# Altium schematic sheet BrightnessControl.SchDoc
size A; SheetNumber: 1; SheetTotal: 1
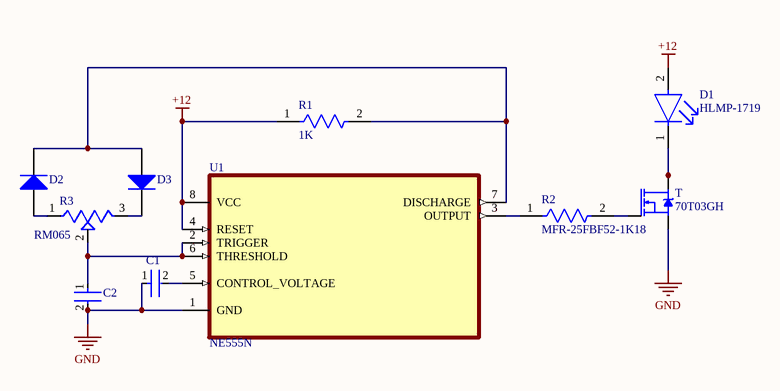
[diagram p0: BrightnessControl.SchDoc]

## Parts
C1  CL21A335KPFNNNG  [FP-CL21-IPC_A]  (value not drawn)
C2  CL21A335KPFNNNG  [FP-CL21-IPC_A]  (value not drawn)
D1  HLMP-1719  [FP-HLMP-1719-MFG]
D2  1N4148  [NXP-SOD27-2_V]  (value not drawn)
D3  1N4148  [NXP-SOD27-2_V]  (value not drawn)
R1  1K  [FP-MFR-25-MFG]
R2  MFR-25FBF52-1K18  [FP-MFR-25-MFG]
R3  RM065  [RM065]
T  70T03GH  [TO252-3]
U1  NE555N  [DIP8]

## Nets
+12: D1.2(A) R1.1 U1.4(RESET) U1.8(VCC)
GND: C1.1 C2.2 T.3(S) U1.1(GND)
NetC1_2: C1.2 U1.5(CONTROL_VOLTAGE)
NetC2_1: C2.1 R3.2(WIPER) U1.2(TRIGGER) U1.6(THRESHOLD)
NetD1_1: D1.1(C) T.2(D) T.PAD(D)
NetD2_1: D2.1(A) R3.1(CCW)
NetD2_2: D2.2(K) D3.1(A) R1.2 U1.7(DISCHARGE)
NetD3_2: D3.2(K) R3.3(CW)
NetR2_1: R2.1 U1.3(OUTPUT)
NetR2_2: R2.2 T.1(G)

## Library data of the parts
C1 C2 = CMP-13271-000579-1: CL21 Series 0805 3.3uF 10V ±10% Tolerance X5R Multilayer Ceramic Chip Capacitor; Case Code (Metric): 2012; Width: 0.049inch; Capacitance: 3.3uF; Mount: Surface Mount; Tolerance: 10%; Min Operating Temperature: -55°C; Depth: 1.25mm; Length: 0.079inch; Case/Package: 0805; Max Operating Temperature: 85°C; Dielectric: X5R; Case Code (Imperial): 0805; Packaging: Tape and Reel; Thickness: 0.053inch; Voltage Rating: 10V; Package Quantity: 3000
D1 = CMP-2000-06410-2: LED YELLOW DIFFUSED T-1 T/H; Manufacturer: Broadcom; Wavelength: 585nm; Led Orientation: Straight; Luminous Intensity: 2.1mcd; Forward Voltage: 1.8V; Viewing Angle: 50°; Reverse Voltage: 5V; Power Dissipation: 17.5mW; Forward Current: 2mA; Lead Free: Yes; Automotive: No; Device Class L1: Optoelectronics; Mouser Description: Standard LEDs - Through Hole Yellow Diffused 585nm 2.1mcd; Digikey Description: LED YELLOW DIFFUSED T-1 T/H; Temperature: -40°C to +100°C; Temperature Range High: +100°C; Package: 0; Category: Diode; Colour: Yellow; Device Class L2: LEDs; ComponentLink2Description: Datasheet; ComponentLink2URL: https://docs.broadcom.com/docs/AV02-1557EN; Temperature Range Low: -40°C; Device Class L3: unset; Octopart: https://octopart.com/hlmp-1719-broadcom-71130405; RoHS: TRUE; Manufacturer Part Number: HLMP-1719
D2 D3 = CMP-0648-00002-1: High-speed Diode, 100 V, 450 mA, 2-Pin SOD27, RoHS; Manufacturer: NXP Semiconductors; Configuration: Single; IR (VR: 20 V)=25 nA; IFRM: 450 mA; IFSM: 4 A Max.; Trr: 4 ns Max.; Cd: 4 pF Max.; VR: 100 V Max.; VF (IF: 10 mA)=1 V; IF: 200 mA Max.; ComponentLink1Description: Manufacturer URL; RoHS: TRUE; ComponentLink1URL: http://www.nxp.com/; ComponentLink3Description: Package Specification; DatasheetVersion: Aug-04; ComponentLink2Description: Datasheet; PackageVersion: Aug-04; PackageReference: SOD27; ComponentLink3URL: http://www.nxp.com/documents/data_sheet/1N4148_1N4448.pdf; Mounting Technology: Through Hole; ComponentLink2URL: http://www.nxp.com/documents/data_sheet/1N4148_1N4448.pdf; PartNumber: 1N4148; PackageDescription: 2-Pin Hermetically Sealed Glass Package, Axial Leaded, Dia 1.85 mm, Body Length 4.25 mm, Lead Spread 25.4 mm
R1 = CMP-03413-000001-1: RES 1.18K OHM 1/4W 1% AXIAL; Manufacturer: Yageo; Manufacturer Part Number: MFR-25FBF52-1K18; Value: 1.18kΩ; Temperature Coefficient: 100ppm/°C; Power Rating: 0.25W; Voltage Rating: 250V; Temperature: -55°C to +155°C; Automotive: No; Temperature Range High: +155°C; Mouser Description: Metal Film Resistors 1.18K OHM 1/4W 1%; Digikey Description: RES 1.18K OHM 1/4W 1% AXIAL; Lead Free: Yes; Tolerance: 1%; ComponentLink2Description: Datasheet; ComponentLink2URL: https://www.yageo.com/upload/media/product/products/datasheet/lr/Yageo_LR_MFR_1.pdf; Temperature Range Low: -55°C; Package: MFR-25; Ipc Land Pattern Name: RESAD1000W75L680D260; Composition: Metal Film; Category: Res; Octopart: https://octopart.com/mfr-25fbf52-1k18-yageo-56251681; Series: MFR; Device Class L2: Resistors; Height: 2.6mm; Resistance: 1.18kΩ; Device Class L3: Through-Hole Resistors; RoHS: TRUE; Device Class L1: Passive Components
R2 = CMP-03413-000001-1: RES 1.18K OHM 1/4W 1% AXIAL; Manufacturer: Yageo; Value: 1.18kΩ; Temperature Coefficient: 100ppm/°C; Power Rating: 0.25W; Voltage Rating: 250V; Temperature: -55°C to +155°C; Automotive: No; Temperature Range High: +155°C; Mouser Description: Metal Film Resistors 1.18K OHM 1/4W 1%; Digikey Description: RES 1.18K OHM 1/4W 1% AXIAL; Lead Free: Yes; Tolerance: 1%; ComponentLink2Description: Datasheet; ComponentLink2URL: https://www.yageo.com/upload/media/product/products/datasheet/lr/Yageo_LR_MFR_1.pdf; Temperature Range Low: -55°C; Package: MFR-25; Ipc Land Pattern Name: RESAD1000W75L680D260; Composition: Metal Film; Category: Res; Octopart: https://octopart.com/mfr-25fbf52-1k18-yageo-56251681; Series: MFR; Device Class L2: Resistors; Height: 2.6mm; Resistance: 1.18kΩ; Device Class L3: Through-Hole Resistors; Manufacturer Part Number: MFR-25FBF52-1K18; RoHS: TRUE; Device Class L1: Passive Components
R3 = RM065: 5 kOhms 0.1W, 1/10W PC Pins Through Hole Trimmer Potentiometer Carbon 1 Turn Top Adjustment; MF: Bourns Inc.; MP: 3318F-1-502; Value: *; Package: DO-214 Bourns Inc.; Availability: Bad; SnapEDA_Link: https://www.snapeda.com/parts/3318F-1-502/Bourns/view-part/3658500/?ref=snap; Check_prices: https://www.snapeda.com/parts/3318F-1-502/Bourns/view-part/3658500/?ref=eda; Price: None
T = 70T03GH: RoHS Compliant | Low RDS_on_ | Industry-leading quality | Dynamic dv/dt Rating | Fast Switching | Fully Avalanche Rated | 175C Operating Temperature | Logic Level; MP: IRLR2905TRPBF; MF: Infineon Technologies; Package: TO-252 Infineon; Availability: Unavailable; Value: *; SnapEDA_Link: https://www.snapeda.com/parts/IRLR2905TRPBF/Infineon%20Technologies/view-part/836333/?ref=snap; Price: None
U1 = NE555N: 555 Type, Timer/Oscillator _Single_ IC 8-DIP; MF: ON Semiconductor; Value: *; Price: None; Package: DIP-8 Texas Instruments; SnapEDA_Link: https://www.snapeda.com/parts/NE555N/ON%20Semiconductor/view-part/2757993/?ref=snap; Availability: Unavailable; MP: NE555N